# Altium schematic sheet UART_USB.SchDoc
size A3; Author: Швецов С.В.; Organization: PapuaSoft; SheetNumber: 8; SheetTotal: 8
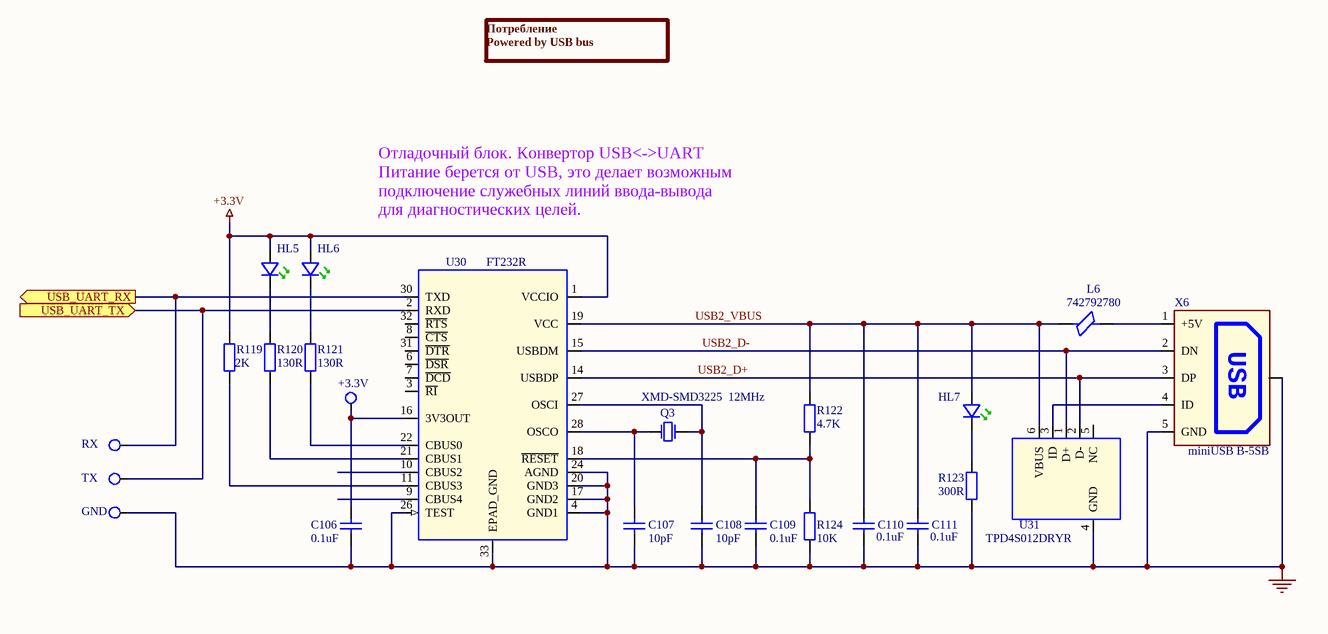
[diagram p0: UART_USB.SchDoc]

## Parts
C106  value 0.1uF  [C0402]  (hidden comment: Cap)
C107  value 10pF  [C0402]  (hidden comment: Cap)
C108  value 10pF  [C0402]  (hidden comment: Cap)
C109  value 0.1uF  [C0402]  (hidden comment: Cap)
C110  value 0.1uF  [C0402]  (hidden comment: Cap)
C111  value 0.1uF  [C0402]  (hidden comment: Cap)
HL5  (no value)  [KP-1608_16x08x11_L]
HL6  (no value)  [KP-1608_16x08x11_L]
HL7  (no value)  [KP-1608_16x08x11_L]
L6  742792780  [L0402]
Q3  XMD-SMD3225  12MHz  [KX-5T]
R119  value 2K  [R0402]  (hidden comment: Res2)
R120  value 130R  [R0402]  (hidden comment: Res2)
R121  value 130R  [R0402]  (hidden comment: Res2)
R122  value 4.7K  [R0402]  (hidden comment: Res2)
R123  value 300R  [R0402]  (hidden comment: Res2)
R124  value 10K  [R0402]  (hidden comment: Res2)
TP21  MarkPCB: +3.3V  [TP_0MM5_1MM0]  (no BOM)
TP22  MarkPCB: RX  [TP_0MM5_1MM0]  (no BOM)
TP23  MarkPCB: TX  [TP_0MM5_1MM0]  (no BOM)
TP24  MarkPCB: GND  [TP_0MM5_1MM0]  (no BOM)
U30  FT232R  [QFN32_FT232RQ_FTD-L]
U31  value TPD4S012DRYR  [TPD4S012DRYR]
X6  value miniUSB B-5SB  [USBSMALL]  (hidden comment: USB)

## Ports
USB_UART_RX (out), USB_UART_TX (in)

## Nets
+3.3V: HL5.1(Anode) HL6.1(Anode) R119.2 U30.1(VCCIO)
GND: C106.2 C107.2 C108.2 C109.2 C110.2 C111.2 R123.2 R124.2 TP24.1(e1) U30.4(GND1) U30.17(GND2) U30.20(GND3) U30.24(AGND) U30.26(TEST) U30.33(EPAD_GND) U31.4(GND) X6.0(PAD) X6.5(GND)
USB2_D+: U30.14(USBDP) U31.2(D-) X6.3(DP)
USB2_D-: U30.15(USBDM) U31.1(D+) X6.2(DN)
USB2_VBUS: C110.1 C111.1 HL7.1(Anode) L6.1 R122.1 U30.19(VCC) U31.6(VBUS)
USB_UART_RX: TP22.1(e1) U30.30(TXD) ; port USB_UART_RX
USB_UART_TX: TP23.1(e1) U30.2(RXD) ; port USB_UART_TX
NetC106_1: C106.1 TP21.1(e1) U30.16(3V3OUT)
NetC107_1: C107.1 Q3.3(OSC2) U30.28(OSCO)
NetC108_1: C108.1 Q3.1(OSC1) U30.27(OSCI)
NetC109_1: C109.1 R122.2 R124.1 U30.18(~{RESET})
NetHL5_2: HL5.2(Cathode) R120.2
NetHL6_2: HL6.2(Cathode) R121.2
NetHL7_2: HL7.2(Cathode) R123.1
NetL6_2: L6.2 X6.1(+5V)
NetR119_1: R119.1 U30.11(CBUS3)
NetR120_1: R120.1 U30.21(CBUS1)
NetR121_1: R121.1 U30.22(CBUS0)
NetU31_3: U31.3(ID) X6.4(ID)

Not connected (* = marked no-connect by the designer): U30 3(~{RI}) 6(~{DSR}) 7(~{DCD}) 8(~{CTS}) 9(CBUS4) 10(CBUS2) 31(~{DTR}) 32(~{RTS}); U31 5(NC)

## Notes on the sheet
- Потребление
  Powered by USB bus
- Отладочный блок. Конвертор USB<->UART
  Питание берется от USB, это делает возможным подключение служебных линий ввода-вывода для диагностических целей.
- Лист
- /
- Изм.
- № докум.
- Подп.
- Дата.

## Library data of the parts
C106 C109-C111 = Cap: Конденсатор керамический; Voltage: 25V; PackageReference: 0402; ClassName: UART_USB
  C109-C111: Parameter 1: *
C107 C108 = Cap: GRM1535C1H100J; PackageReference: 0402; ClassName: UART_USB
HL5-HL7 = ledG_KP-1608MGC_KP-1608: 1.6X0.8mm SMD  LED; LxWxH(mm): 1,6x0,8x1,1; Value: KP-1608MGC; PackageReference: 0603; Package: KP-1608_16x08x11; ClassName: UART_USB
  HL7: Parameter 1: *
L6 = BEAD_FERRITE_SM: Wurth Elektronik EMI FILTERS FERRITE BEAD, 220R@100MHz, 0.35R; PackageReference: 0402; Value: 742792780; ClassName: UART_USB
Q3 = XTAL: Chengdu Kingbri Frequency Technology Co., Ltd  12MHz; Value: 01XMD118JVF0012000000; PackageReference: SMD 3.2x2.5мм; ClassName: UART_USB
R119-R124 = Res2: Резистор; PackageReference: 0402; ClassName: UART_USB
  R122-R124: Parameter 1: *
TP21-TP24 = Test_Point: Тестовая точка на плате; ClassName: UART_USB
U30 = FT232R_2: USB to serial UART interface; Part Class: ICS; Item Num: P01-17819R; Value: FT232RQ-REEL; Device: U17; Num Pins: 32; PackageReference: QFN32; ClassName: UART_USB
U31 = TPD4S012DRYR: Защитные диоды USB; PackageReference: SON6; ClassName: UART_USB; Parameter 1: *
X6 = USB: 5-контактная SMD розетка; ClassName: UART_USB; Parameter 1: *